# Altium schematic sheet Backplane_Breakout_Adapter_Pico.SchDoc: Raspberry Pi Pico
size B; Date: 10/07/2021; Author: Robert Pafford; Organization: ORGANIZATION; Address1: ADDRESS 1; Address2: ADDRESS 2; Address3: ADDRESS 3; Address4: ADDRESS 4; Revision: -; SheetNumber: 2; SheetTotal: 3; ENG_APP_DATE: --/--/--; DSN_APP_DATE: --/--/--; CHK_APP_DATE: --/--/--
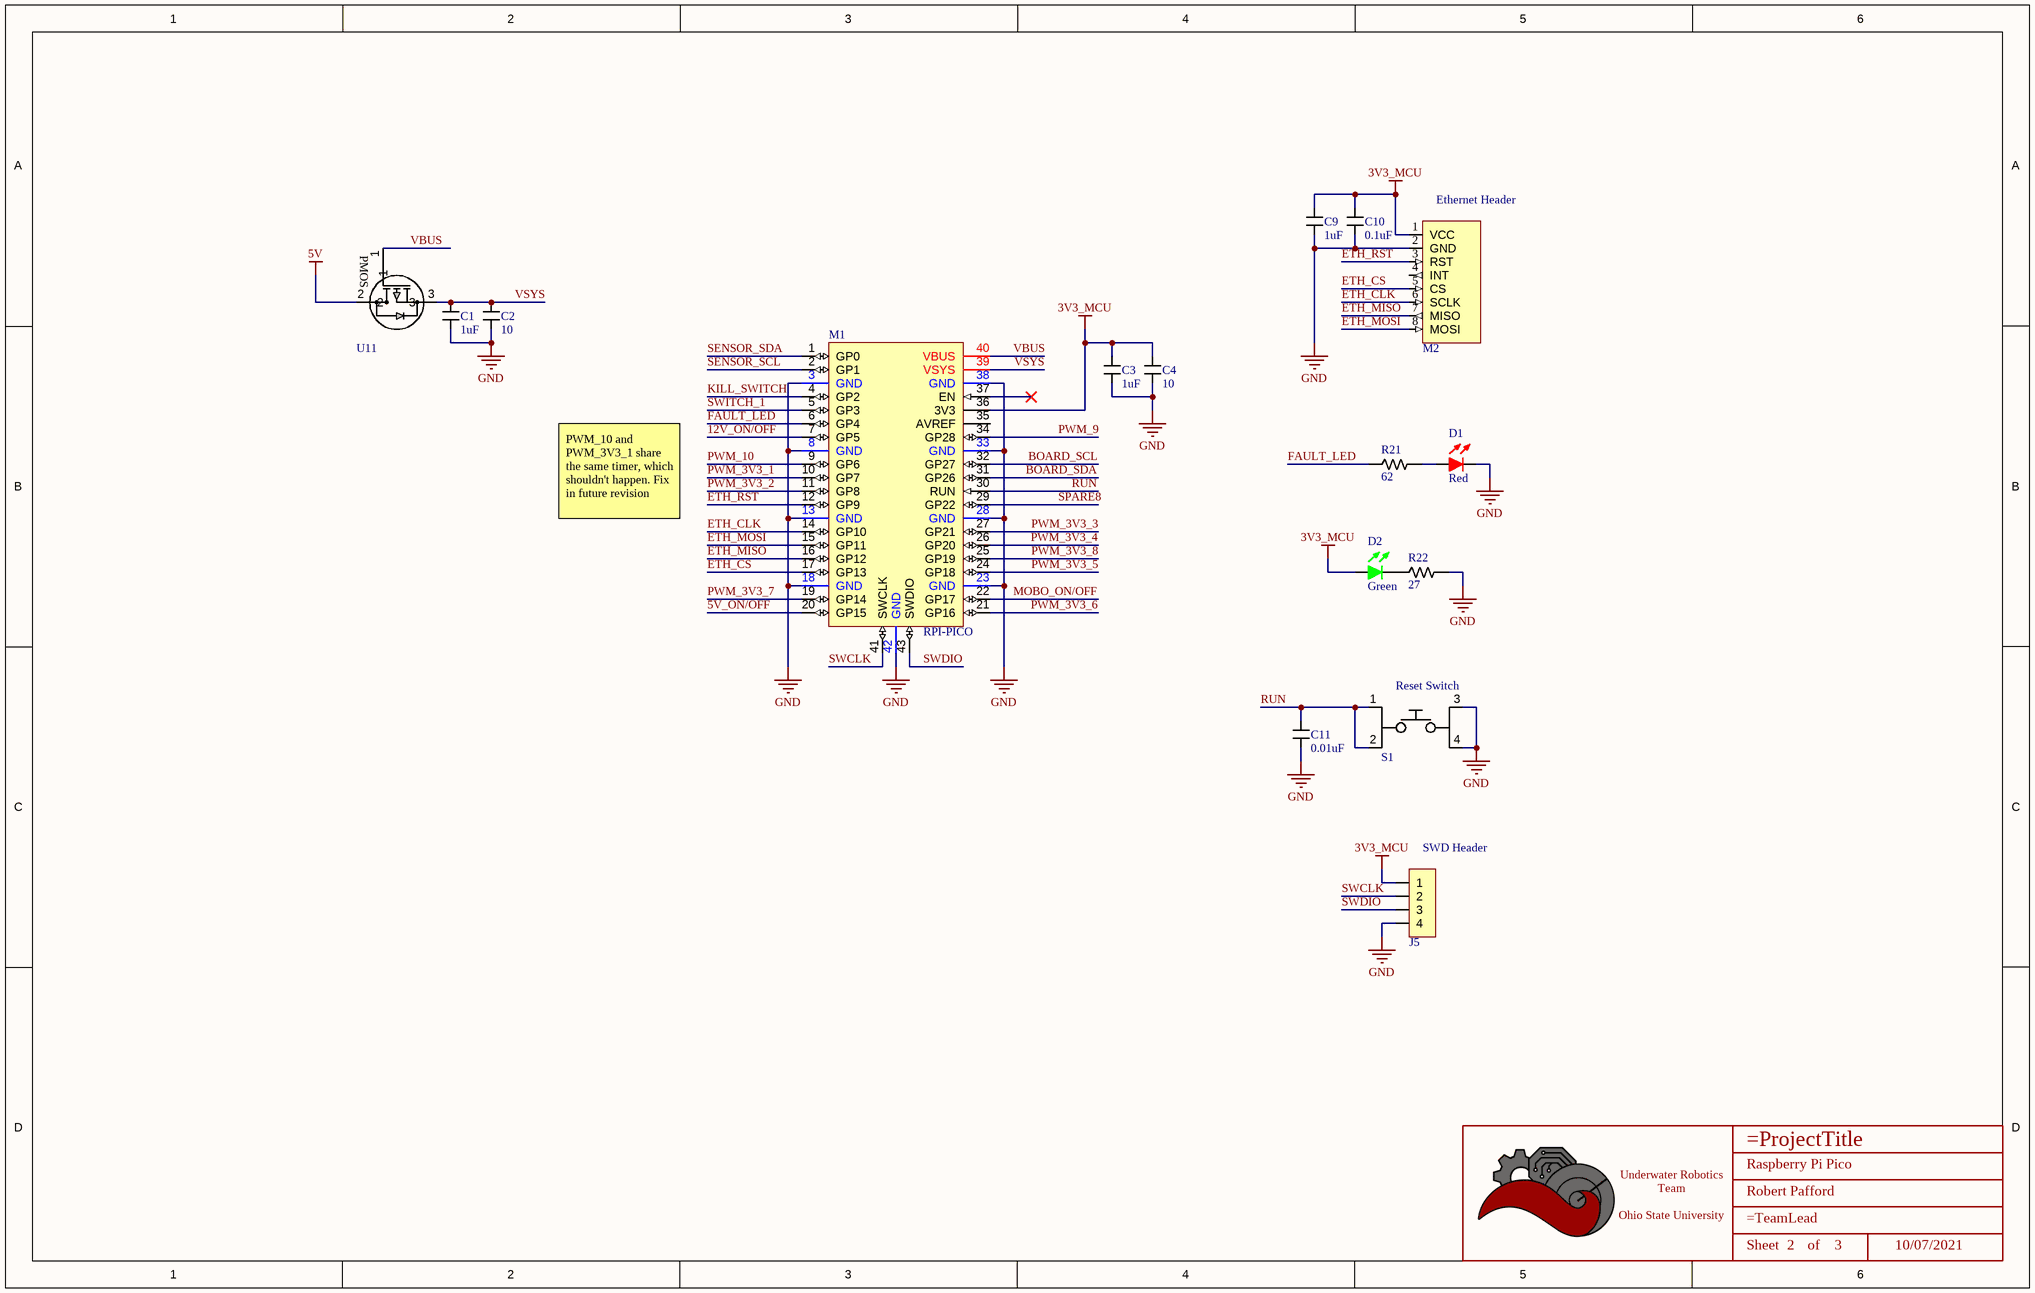
[diagram p0: Backplane_Breakout_Adapter_Pico.SchDoc]

## Parts
*  Title_Block  [LOGO]  (value not drawn)  (graphical)
C1  value 1uF  [CAPACITOR_0603]  (hidden comment: 1uF Ceramic 16V)
C2  Value (uF): 10  [CAPACITOR_0603]  (hidden comment: 10uF Ceramic 6.3V)
C3  value 1uF  [CAPACITOR_0603]  (hidden comment: 1uF Ceramic 16V)
C4  Value (uF): 10  [CAPACITOR_0603]  (hidden comment: 10uF Ceramic 6.3V)
C9  value 1uF  [CAPACITOR_0603]  (hidden comment: 1uF Ceramic 16V)
C10  value 0.1uF  [CAPACITOR_0603]  (hidden comment: 100nF Ceramic 6.3V)
C11  value 0.01uF  [CAPACITOR_0603]  (hidden comment: 10nF Ceramic 6.3V)
D1  Color: Red  [LED_0603]  (hidden comment: 150060RS75000)
D2  Color: Green  [LED_0603]  (hidden comment: 150060GS75000)
J5  CONN HEADER VERT 4POS 2.54MM  [HEADER_4PIN_2.54MM]  (value not drawn)
M1  RPI-PICO  [RPI-PICO-MOD]
M2  W5x00 Breakout Board  [W5500IO-P]  (value not drawn)
R21  Value  (Ohms): 62  [RESISTOR_0603]  (hidden comment: 62 Ohm 1% 1/4W)
R22  Value  (Ohms): 27  [RESISTOR_0603]  (hidden comment: 27 Ohm 5% 1/8W)
S1  SPST Tactile Switch  [TactileSwitch]  (value not drawn)
U11  MOSFET P-CHANNEL 20V 4.7A SOT23  [SOT-23-3]  (value not drawn)

## Nets
3V3_MCU: C3.1 C4.1 C9.1 C10.1 D2.1 J5.1 M1.36(3V3) M2.1(VCC)
5V: U11.2
GND: C1.2 C2.2 C3.2 C4.2 C9.2 C10.2 C11.2 D1.2 J5.4 M1.3(GND) M1.8(GND) M1.13(GND) M1.18(GND) M1.23(GND) M1.28(GND) M1.33(GND) M1.38(GND) M1.42(GND) M2.2(GND) R22.1 S1.3 S1.4
5V_ON/OFF: M1.20(GP15)
12V_ON/OFF: M1.7(GP5)
BOARD_SCL: M1.32(GP27)
BOARD_SDA: M1.31(GP26)
ETH_CLK: M1.14(GP10) M2.6(SCLK)
ETH_CS: M1.17(GP13) M2.5(CS)
ETH_MISO: M1.16(GP12) M2.7(MISO)
ETH_MOSI: M1.15(GP11) M2.8(MOSI)
ETH_RST: M1.12(GP9) M2.3(RST)
FAULT_LED: M1.6(GP4) R21.2
KILL_SWITCH: M1.4(GP2)
MOBO_ON/OFF: M1.22(GP17)
PWM_3V3_1: M1.10(GP7)
PWM_3V3_2: M1.11(GP8)
PWM_3V3_3: M1.27(GP21)
PWM_3V3_4: M1.26(GP20)
PWM_3V3_5: M1.24(GP18)
PWM_3V3_6: M1.21(GP16)
PWM_3V3_7: M1.19(GP14)
PWM_3V3_8: M1.25(GP19)
PWM_9: M1.34(GP28)
PWM_10: M1.9(GP6)
RUN: C11.1 M1.30(RUN) S1.1 S1.2
SENSOR_SCL: M1.2(GP1)
SENSOR_SDA: M1.1(GP0)
SPARE8: M1.29(GP22)
SWCLK: J5.2 M1.41(SWCLK)
SWDIO: J5.3 M1.43(SWDIO)
SWITCH_1: M1.5(GP3)
VBUS: M1.40(VBUS) U11.1
VSYS: C1.1 C2.1 M1.39(VSYS) U11.3
NetD1_1: D1.1 R21.1
NetD2_2: D2.2 R22.2

Not connected (* = marked no-connect by the designer): M1 35(AVREF) 37(EN)*; M2 4(INT)

## Notes on the sheet
- (near M2) Ethernet Header
- PWM_10 and PWM_3V3_1 share the same timer, which shouldn't happen. Fix in future revision
- (near S1) Reset Switch
- (near J5) SWD Header
- DWG. NO.
- REV.
- SHT.
- THIS DOCUMENT AND THE DATA DISCLOSED HEREIN OR HEREWITH IS THE PROPERTY OF ALTIUM LIMITED AND MAY BE FREELY DISTRIBUTED IN WHOLE. NO RIGHTS ARE RESERVED OR EXPRESS OR IMPLIED WARANTEE GIVEN.
- REVISION
- DESCRIPTION
- DATE
- APPROVED
- ENG:
- APPROVALS
- PROJECT
- DSN:
- CHK:
- REFERENCE DOCUMENTS
- PROJECT REVISION:
- TITLE
- DOCUMENT REVISION:
- DESIGN ITEM:
- BOM:
- FAB DWG:
- PCB DWG:
- ASSY DWG:
- SCALE:
- SIZE
- B
- CAGE CODE
- FILE NAME
- DWG NO.
- SHEET
- OF
- REV
- (in symbol Title_Block) Underwater Robotics Team / Ohio State University; Sheet; of
- (in symbol TSM500P02CX) PMOS

## Library data of the parts
* = Title_Block: UWRT Schematic Title Block Template / Created June 2021, Dylan Trainor
C1 C3 C9 = CAPACITOR_1uF_0603: Cap 1uF 16V +/-10% / Ceramic 0603; Made By: Flip B; Tolerance: +/- 10%; Voltage: 16V; Supplier 1: Digi-Key; Supplier Part Number 1: 399-7847-1-ND
C2 C4 = CAPACITOR_10uF_0603: Cap 10uF 6.3V +/-20% / Ceramic 0603; Made By: Flip B; ComponentLink1Description: Digikey; ComponentLink1URL: https://www.digikey.com/en/products/detail/samsung-electro-mechanics/CL10A106MQ8NNNC/3886777; Supplier 1: Digi-Key; Supplier Part Number 1: 1276-1119-1-ND; Tolerance: +/- 20%; Voltage: 6.3V
C10 = CAPACITOR_0.1uF_0603: Cap 100nF 6.3V +/-10% / Ceramic 0603; Made By: Flip B; ComponentLink1Description: Datsheet; ComponentLink1URL: https://www.mouser.com/datasheet/2/212/KEM_C1002_X7R_SMD-1102033.pdf; Tolerance: +/- 10%; Voltage: 6.3V; Supplier 1: Digi-Key; Supplier Part Number 1: 399-15351-1-ND
C11 = CAPACITOR_0.01uF_0603: Cap 10nF 6.3V +/-20% / Ceramic 0603; Tolerance: +/- 10%; Made By: Flip B; ComponentLink1Description: Datsheet; ComponentLink1URL: https://www.mouser.com/datasheet/2/212/KEM_C1002_X7R_SMD-1102033.pdf; Voltage: 6.3V; Supplier 1: Mouser; Supplier Part Number 1: 80-C0603C103K9R
D1 = LED_Red_0603: LED Red Vf= 2V If = 0.020A / IN-S63AT5G; Made By: Robert Pafford; Forward Current: 20mA; ComponentLink1Description: Datasheet; ComponentLink1URL: https://www.we-online.de/katalog/datasheet/150060GS75000.pdf; Forward Voltage: 2V; Package: 0603; Supplier 1: Digi-Key; Supplier Part Number 1: 732-4978-1-ND
D2 = LED_Green_0603_3.2V: LED Green Vf= 3.2V If = 0.025A / 150060GS75000; Made By: Flip B; Forward Current: 25mA; Supplier 1: Digi-Key; ComponentLink1Description: Datasheet; ComponentLink1URL: https://www.we-online.de/katalog/datasheet/150060GS75000.pdf; Supplier Part Number 1: 732-4971-1-ND; Forward Voltage: 3.2V; Package: 0603
J5 = HEADER_4PIN_2.54MM: Made By: Robert Pafford; Supplier 1: Digi-Key; Supplier Part Number 1: S1012E-04-ND
M1 = RPI-PICO-MOD_SM: RASPBERRY PI PICO RP2040 BOARD NO TEST PADS; Manufacturer: Raspberry Pi Foundation; Manufacturer Part No: SC0915; Mounting Technology: SMT; Supplier: DigiKey; Supplier Part No: 2648-SC0915CT-ND; Supplier Link: https://www.digikey.com/en/products/detail/raspberry-pi/SC0915/13684020; ComponentLink1Description: Footprint Source; ComponentLink1URL: https://github.com/amgsus/RPi-Pico-Altium
M2 = W5500IO-P: W5x00 Breakout Board (W5500IO-P Compatible boards); Made By: Robert Pafford; Voltage: 3.3V; ComponentLink1Description: Product Webpage; ComponentLink1URL: https://maker.wiznet.io/2019/04/02/w5500io-p/
R21 = RESISTOR_62_0603: RES SMD 62 OHM 1% 1/4W 0603; Tolerance: +/- 1%; Made By: Robert Pafford; ComponentLink1Description: Datasheet; ComponentLink1URL: https://www.bourns.com/docs/product-datasheets/CRxxxxx.pdf; Wattage: 1/4W; Supplier: Digikey; Digikey Part Numer: CR0603-JW-104ELFTR-ND; Supplier 1: Digi-Key; Supplier Part Number 1: 541-RCS060362R0FKEACT-ND
R22 = RESISTOR_27_0603: RES 27 OHM 5% 1/8W 0603; Tolerance: +/- 5%; Made By: Robert Pafford; ComponentLink1Description: Datasheet; ComponentLink1URL: https://www.bourns.com/docs/product-datasheets/CRxxxxx.pdf; Wattage: 1/8W; Supplier: Digikey; Digikey Part Numer: CR0603-JW-104ELFTR-ND; Supplier 1: Digi-Key; Supplier Part Number 1: 2019-RK73B1JTTD270JCT-ND
S1 = Tactile Switch: SWITCH TACTILE SPST-NO 0.05A 12V; Made By: Robert Pafford; Supplier 1: Digi-Key; Supplier Part Number 1: EG2494-ND
U11 = TSM500P02CX: P-Channel 20 V 4.7A (Tc) 1.56W (Tc) Surface Mount SOT-23; Vendor: Taiwan Semiconductor Corporation; Vgs (Max): ±10V; Vgs (th): 800mV @ 250µA; Rds (on): 50mOhm @ 3A, 4.5V; Amp Rating: 4.7 A; FET Type: P-Channel; Package: TO-236-3, SC-59, SOT-23-3; Manufacturer_Part_Number: TSM500P02CX; Vdss: 20 V; Power Dissipation: 1.56W (Tc); Created By: Robert Pafford; Supplier 1: Digi-Key; Supplier Part Number 1: TSM500P02CXRFGCT-ND